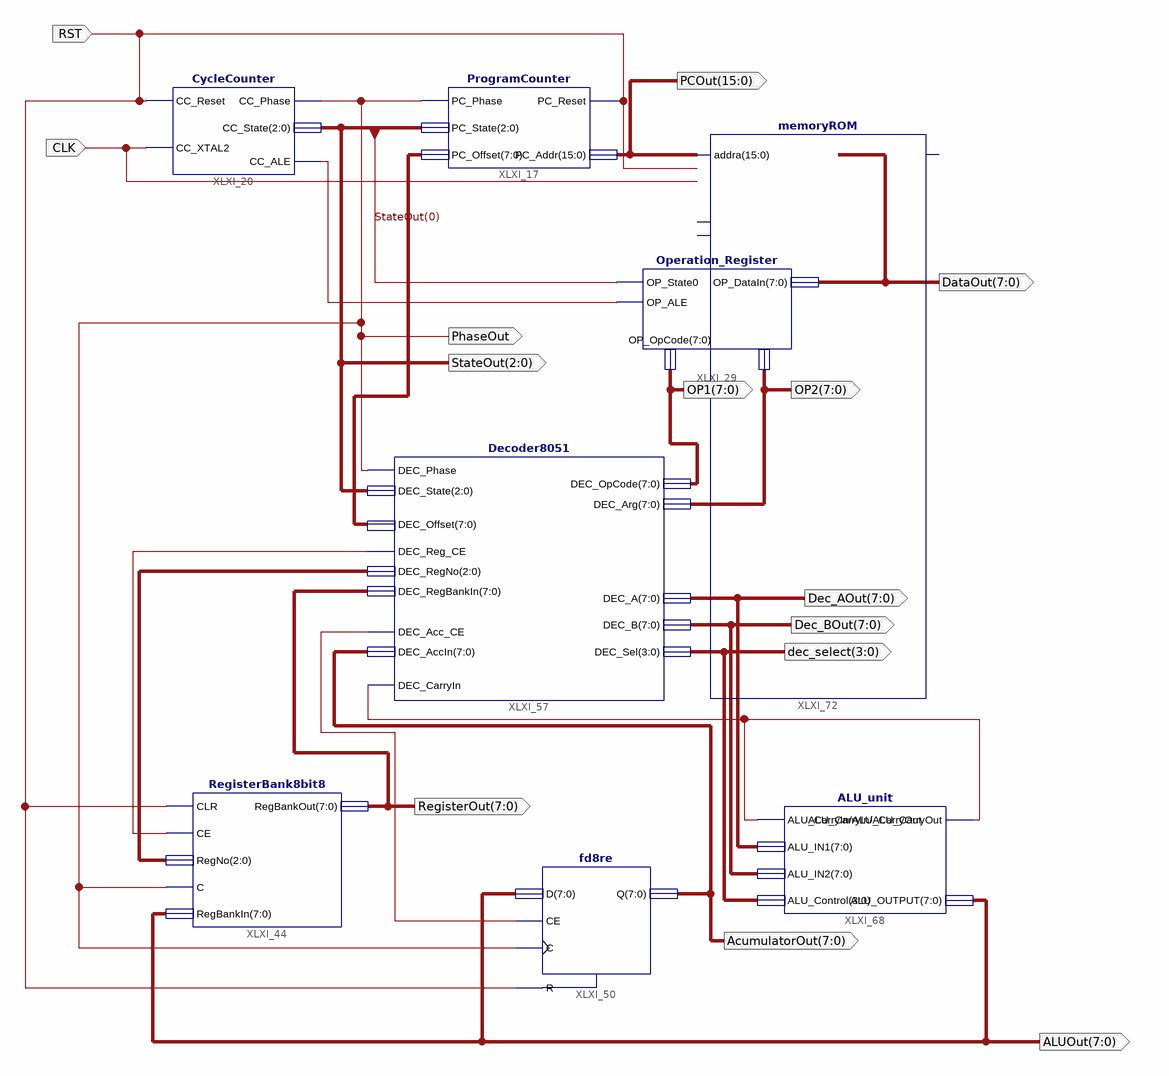
[diagram p0: schematic sheet 1]
// Xilinx ISE schematic Intel8051.sch (spartan3e) as structural Verilog: 8 symbols, 14 ports
module Intel8051 (
  input  RST,
  input  CLK,
  output [15:0] PCOut,
  output [7:0] DataOut,
  output [2:0] StateOut,
  output PhaseOut,
  output [7:0] OP2,
  output [7:0] OP1,
  output [7:0] AcumulatorOut,
  output [7:0] RegisterOut,
  output [7:0] Dec_AOut,
  output [7:0] Dec_BOut,
  output [3:0] dec_select,
  output [7:0] ALUOut
);

  wire XLXN_44, XLXN_97, XLXN_104, XLXN_125;
  wire [2:0] XLXN_98;
  wire [7:0] XLXN_95;

  CycleCounter XLXI_20 (.CC_XTAL2(CLK), .CC_Reset(RST), .CC_Phase(PhaseOut), .CC_ALE(XLXN_44), .CC_State(StateOut));
  ProgramCounter XLXI_17 (
    .PC_Phase(PhaseOut), .PC_State(StateOut), .PC_Offset(XLXN_95), .PC_Reset(RST), .PC_Addr(PCOut));
  Operation_Register XLXI_29 (
    .OP_State0(StateOut[0]), .OP_ALE(XLXN_44), .OP_DataIn(DataOut), .OP_OpCode(OP1), .OP_Arg(OP2));
  RegisterBank8bit8 XLXI_44 (
    .CLR(RST), .CE(XLXN_97), .RegNo(XLXN_98), .C(PhaseOut), .RegBankIn(ALUOut), .RegBankOut(RegisterOut));
  fd8re XLXI_50 (.C(PhaseOut), .CE(XLXN_104), .D(ALUOut), .R(RST), .Q(AcumulatorOut));
  Decoder8051 XLXI_57 (
    .DEC_Phase(PhaseOut), .DEC_CarryIn(XLXN_125), .DEC_State(StateOut), .DEC_RegBankIn(RegisterOut),
    .DEC_AccIn(AcumulatorOut), .DEC_OpCode(OP1), .DEC_Arg(OP2), .DEC_Reg_CE(XLXN_97), .DEC_Acc_CE(XLXN_104),
    .DEC_Offset(XLXN_95), .DEC_RegNo(XLXN_98), .DEC_A(Dec_AOut), .DEC_B(Dec_BOut), .DEC_Sel(dec_select));
  ALU_unit XLXI_68 (
    .ALU_CarryIn(XLXN_125), .ALU_IN1(Dec_AOut), .ALU_IN2(Dec_BOut), .ALU_Control(dec_select),
    .ALU_CarryOut(XLXN_125), .ALU_OUTPUT(ALUOut));
  memoryROM XLXI_72 (.addra(PCOut));  // open: rsta, clka, douta
endmodule
